# Altium schematic sheet 1_P1.schdoc
size 431 x 309 mm; Symbol: Sheet-Symbol_A3; Device: Sheet-Symbol_A3; @Page Name: P1; @Create Date: 2023-02-15; @Page Count: 1; @Page No: 1; @Project Name: 辉光管学习设计; @Schematic Name: Schematic2; @Update Date: 2023-02-15; Company: 嘉立创EDA; Page Size: A3; Version: V1.0
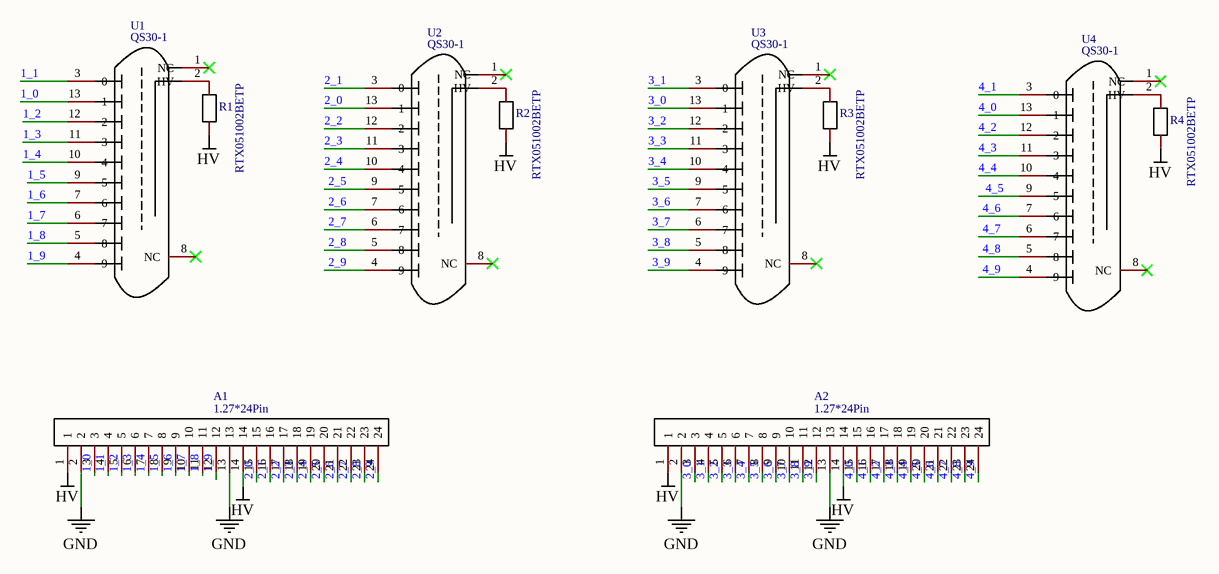
[diagram p0: 1_P1.schdoc]

## Parts
A1  1.27*24Pin  [1.27*24PIN_MYSELF]
A2  1.27*24Pin  [1.27*24PIN_MYSELF]
R1  RTX051002BETP  [R0805]
R2  RTX051002BETP  [R0805]
R3  RTX051002BETP  [R0805]
R4  RTX051002BETP  [R0805]
U1  QS30-1  [QS30-1管座]
U2  QS30-1  [QS30-1管座]
U3  QS30-1  [QS30-1管座]
U4  QS30-1  [QS30-1管座]

## Nets
GND: A1.2 A1.13 A2.2 A2.13
HV: A1.1 A1.14 A2.1 A2.14 R1.1 R2.1 R3.1 R4.1
1_0: A1.3 U1.13(1)
1_1: A1.4 U1.3(0)
1_2: A1.5 U1.12(2)
1_3: A1.6 U1.11(3)
1_4: A1.7 U1.10(4)
1_5: A1.8 U1.9(5)
1_6: A1.9 U1.7(6)
1_7: A1.10 U1.6(7)
1_8: A1.11 U1.5(8)
1_9: A1.12 U1.4(9)
2_0: A1.15 U2.13(1)
2_1: A1.16 U2.3(0)
2_2: A1.17 U2.12(2)
2_3: A1.18 U2.11(3)
2_4: A1.19 U2.10(4)
2_5: A1.20 U2.9(5)
2_6: A1.21 U2.7(6)
2_7: A1.22 U2.6(7)
2_8: A1.23 U2.5(8)
2_9: A1.24 U2.4(9)
3_0: A2.3 U3.13(1)
3_1: A2.4 U3.3(0)
3_2: A2.5 U3.12(2)
3_3: A2.6 U3.11(3)
3_4: A2.7 U3.10(4)
3_5: A2.8 U3.9(5)
3_6: A2.9 U3.7(6)
3_7: A2.10 U3.6(7)
3_8: A2.11 U3.5(8)
3_9: A2.12 U3.4(9)
4_0: A2.15 U4.13(1)
4_1: A2.16 U4.3(0)
4_2: A2.17 U4.12(2)
4_3: A2.18 U4.11(3)
4_4: A2.19 U4.10(4)
4_5: A2.20 U4.9(5)
4_6: A2.21 U4.7(6)
4_7: A2.22 U4.6(7)
4_8: A2.23 U4.5(8)
4_9: A2.24 U4.4(9)
NetR1_2: R1.2 U1.2(HV)
NetR2_2: R2.2 U2.2(HV)
NetR3_2: R3.2 U3.2(HV)
NetR4_2: R4.2 U4.2(HV)

Not connected (* = marked no-connect by the designer): U1 1(NC)* 8(NC)*; U2 1(NC)* 8(NC)*; U3 1(NC)* 8(NC)*; U4 1(NC)* 8(NC)*

## Notes on the sheet
- 1
- 2
- 3
- 4
- 5
- 6
- A
- B
- C
- Schematic
- Schematic2
- Create Date
- Update Date
- 2023-02-15
- D
- Reviewed
- Drawed
- Page
- P1
- Part Number
- 辉光管学习设计
- VER
- SIZE
- PAGE
- OF
- V1.0
- A3
- 嘉立创EDA

## Library data of the parts
A1 A2 = 1.27*24Pin: Add into BOM: yes; Name: 1.27*24Pin; Symbol: 1.27*24Pin; Device: 1.27*24Pin; Convert to PCB: yes; Origin Footprint: 1.27*24PIN_MYSELF
R1-R4 = RTX051002BETP: Manufacturer: RALEC(旺诠); 3DModel: R0805_L2.0-W1.3-H0.6; Add into BOM: yes; Name: RTX051002BETP; Symbol: RTX051002BETP; Device: RTX051002BETP; link: https://item.szlcsc.com/142685.html; Supplier: LCSC; Supplier Part: C5141148; Manufacturer Part: RTX051002BETP; Convert to PCB: yes; Origin Footprint: R0805
U1-U4 = QS30-1: Add into BOM: yes; Name: QS30-1; Symbol: QS30-1; Device: QS30-1; Convert to PCB: yes; Origin Footprint: QS30-1管座